# Altium schematic sheet csi.SchDoc
size 420 x 297 mm
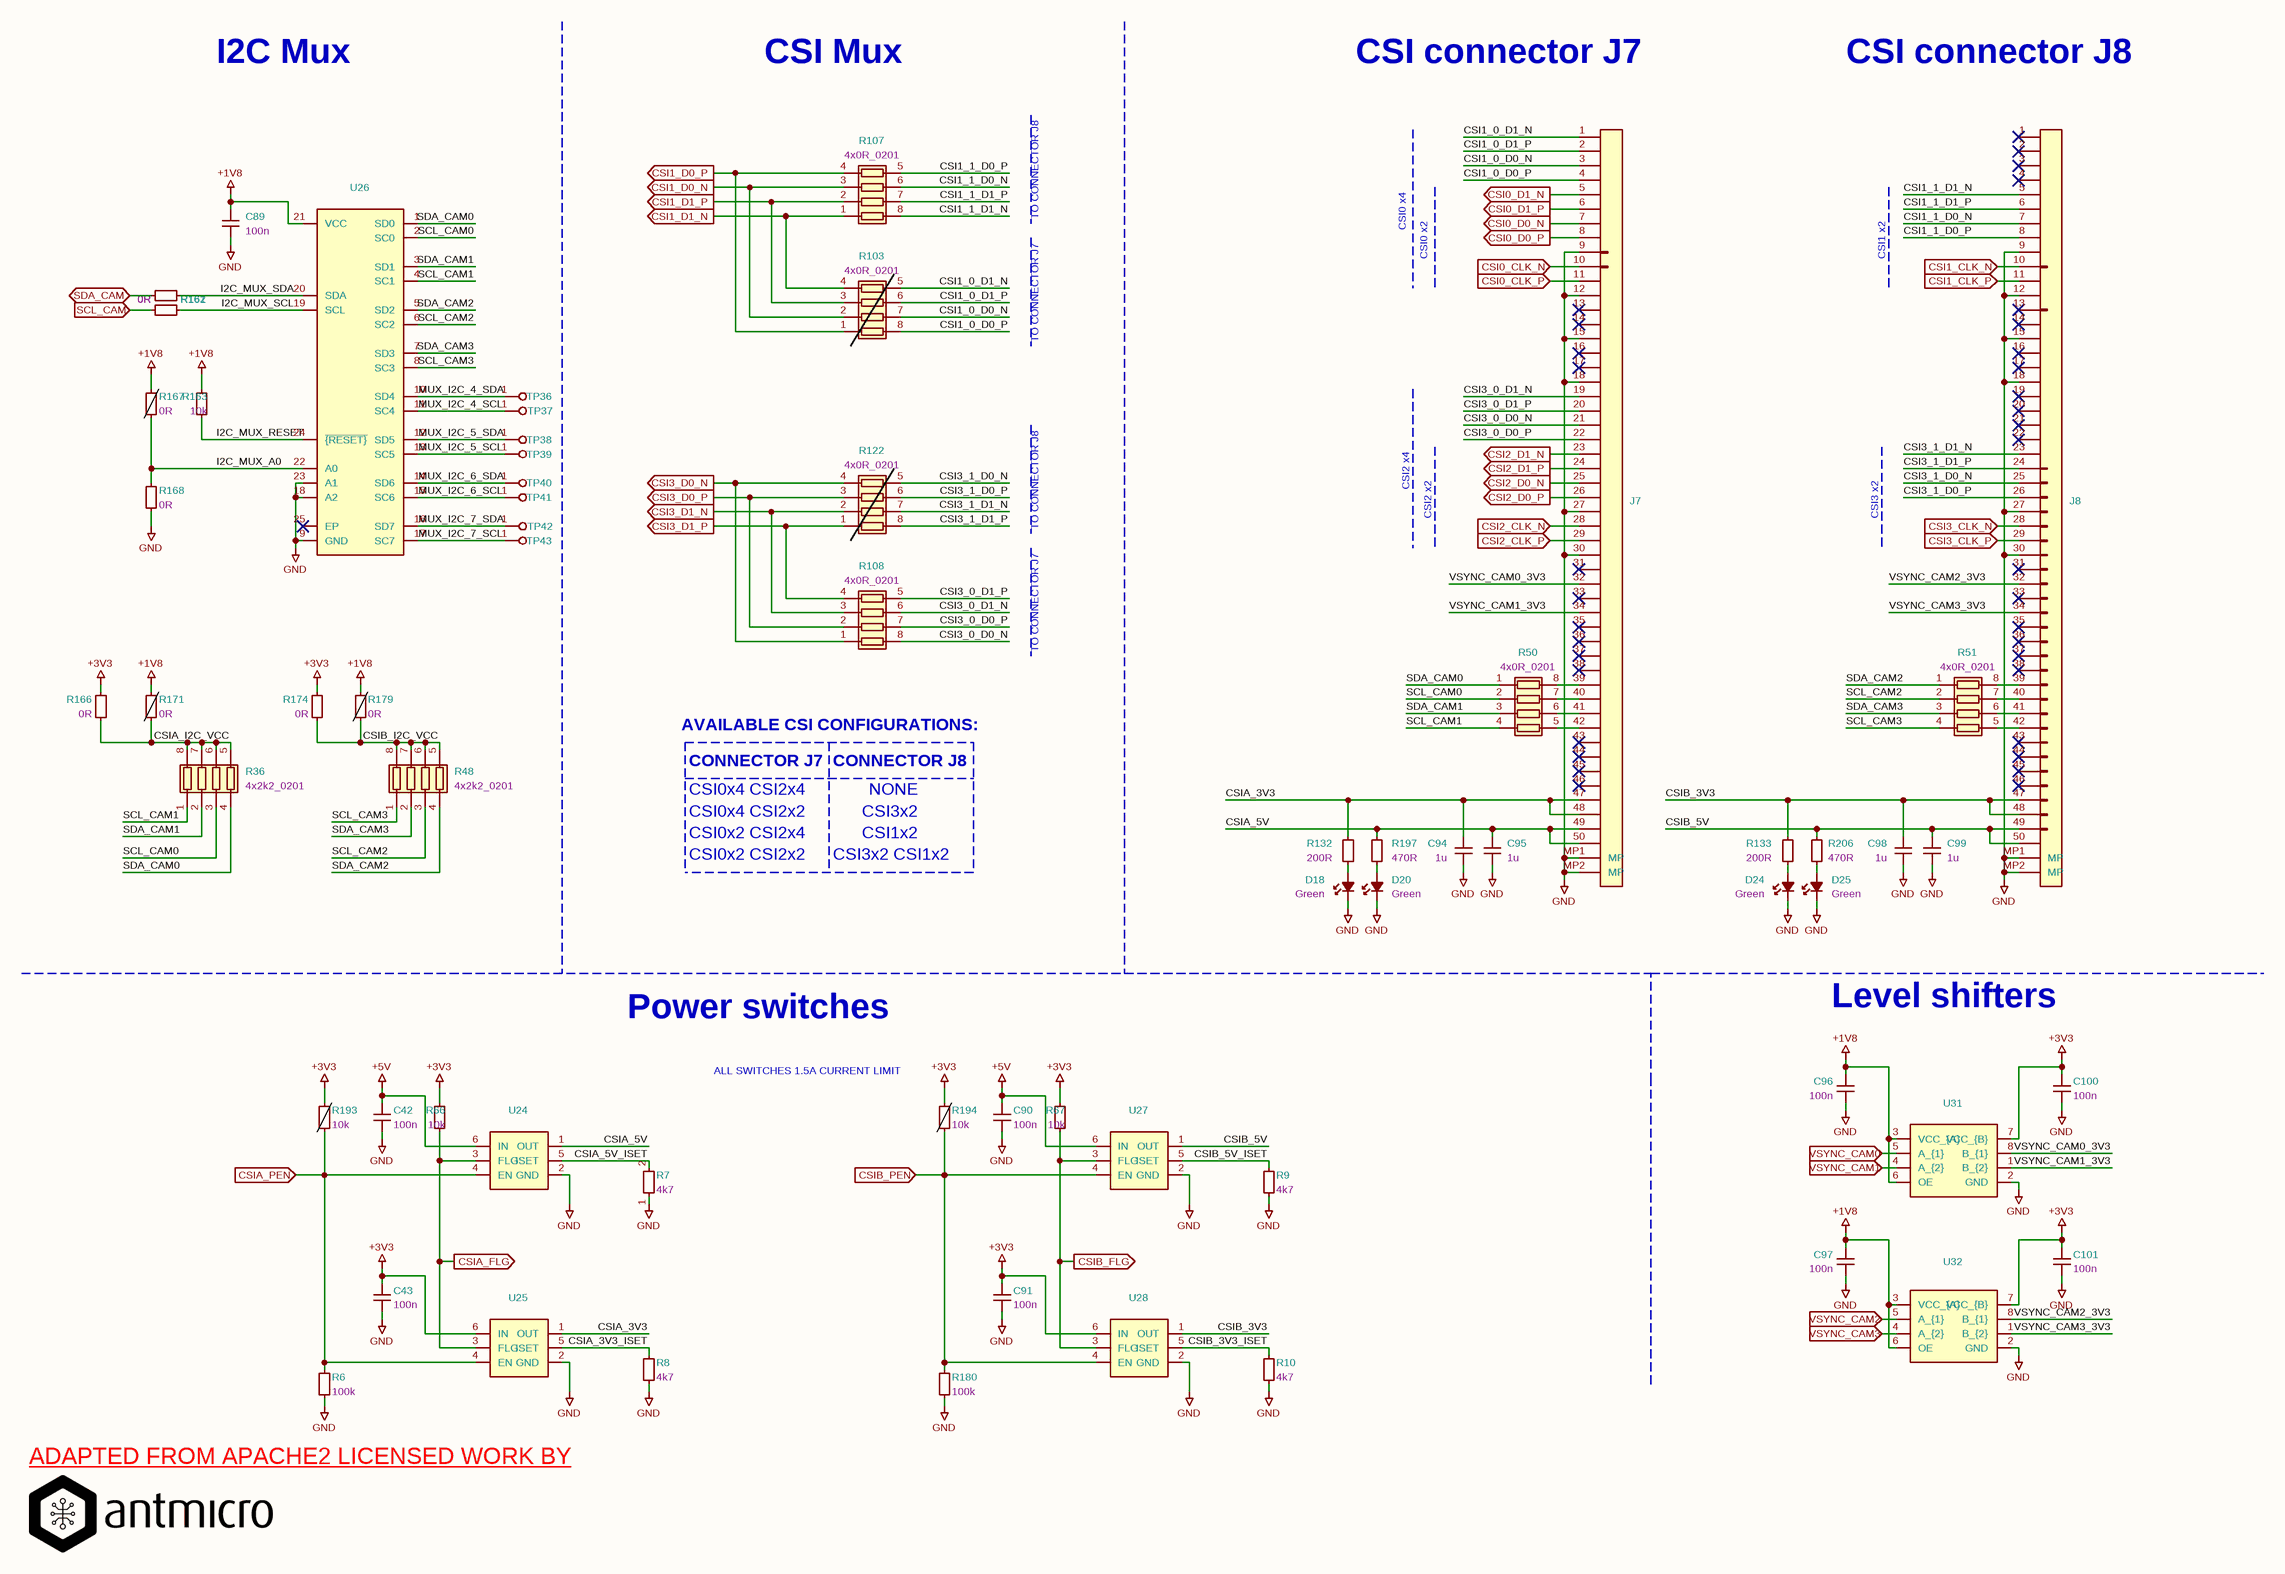
[diagram p0: csi.SchDoc]

## Parts
C42  Val: 100n  [C_0402_1005Metric]  (hidden comment: GRM155R61H104KE14D)
C43  Val: 100n  [C_0402_1005Metric]  (hidden comment: GRM155R61H104KE14D)
C89  Val: 100n  [C_0402_1005Metric]  (hidden comment: GRM155R61H104KE14D)
C90  Val: 100n  [C_0402_1005Metric]  (hidden comment: GRM155R61H104KE14D)
C91  Val: 100n  [C_0402_1005Metric]  (hidden comment: GRM155R61H104KE14D)
C94  Val: 1u  [C_0402_1005Metric]  (hidden comment: C1005X6S1A105K050BC)
C95  Val: 1u  [C_0402_1005Metric]  (hidden comment: C1005X6S1A105K050BC)
C96  Val: 100n  [C_0402_1005Metric]  (hidden comment: GRM155R61H104KE14D)
C97  Val: 100n  [C_0402_1005Metric]  (hidden comment: GRM155R61H104KE14D)
C98  Val: 1u  [C_0402_1005Metric]  (hidden comment: C1005X6S1A105K050BC)
C99  Val: 1u  [C_0402_1005Metric]  (hidden comment: C1005X6S1A105K050BC)
C100  Val: 100n  [C_0402_1005Metric]  (hidden comment: GRM155R61H104KE14D)
C101  Val: 100n  [C_0402_1005Metric]  (hidden comment: GRM155R61H104KE14D)
D18  Color: Green  [LED_0603_1608Metric_G]  (hidden comment: LTST-C190GKT)
D20  Color: Green  [LED_0603_1608Metric_G]  (hidden comment: LTST-C190GKT)
D24  Color: Green  [LED_0603_1608Metric_G]  (hidden comment: LTST-C190GKT)
D25  Color: Green  [LED_0603_1608Metric_G]  (hidden comment: LTST-C190GKT)
J7  68715014522  [Conn_FFC_WE_68715014x22]  (value not drawn)
J8  68715014522  [Conn_FFC_WE_68715014x22]  (value not drawn)
R6  Val: 100k  [R_0402_1005Metric]  (hidden comment: CR0402-FX-1003GLF)
R7  Val: 4k7  [R_0402_1005Metric]  (hidden comment: CR0402-FX-4701GLF)
R8  Val: 4k7  [R_0402_1005Metric]  (hidden comment: CR0402-FX-4701GLF)
R9  Val: 4k7  [R_0402_1005Metric]  (hidden comment: CR0402-FX-4701GLF)
R10  Val: 4k7  [R_0402_1005Metric]  (hidden comment: CR0402-FX-4701GLF)
R36  Val: 4x2k2_0201  [R_Array_4x0201_Panasonic_EXB18V]  (hidden comment: EXB-18V222JX)
R48  Val: 4x2k2_0201  [R_Array_4x0201_Panasonic_EXB18V]  (hidden comment: EXB-18V222JX)
R50  Val: 4x0R_0201  [R_Array_4x0201_Panasonic_EXB18V]  (hidden comment: EXB-18VR000X)
R51  Val: 4x0R_0201  [R_Array_4x0201_Panasonic_EXB18V]  (hidden comment: EXB-18VR000X)
R66  Val: 10k  [R_0402_1005Metric]  (hidden comment: CR0402-FX-1002GLF)
R67  Val: 10k  [R_0402_1005Metric]  (hidden comment: CR0402-FX-1002GLF)
R103  Val: 4x0R_0201  [R_Array_4x0201_Panasonic_EXB18V]  (hidden comment: EXB-18VR000X)  (no BOM)
R107  Val: 4x0R_0201  [R_Array_4x0201_Panasonic_EXB18V]  (hidden comment: EXB-18VR000X)
R108  Val: 4x0R_0201  [R_Array_4x0201_Panasonic_EXB18V]  (hidden comment: EXB-18VR000X)
R122  Val: 4x0R_0201  [R_Array_4x0201_Panasonic_EXB18V]  (hidden comment: EXB-18VR000X)  (no BOM)
R132  Val: 200R  [R_0402_1005Metric]  (hidden comment: CR0402-FX-2000GLF)
R133  Val: 200R  [R_0402_1005Metric]  (hidden comment: CR0402-FX-2000GLF)
R161  Val: 0R  [R_0402_1005Metric]  (hidden comment: ERJ2GE0R00X)
R162  Val: 0R  [R_0402_1005Metric]  (hidden comment: ERJ2GE0R00X)
R163  Val: 10k  [R_0402_1005Metric]  (hidden comment: CR0402-FX-1002GLF)
R166  Val: 0R  [R_0402_1005Metric]  (hidden comment: ERJ2GE0R00X)
R167  Val: 0R  [R_0402_1005Metric]  (hidden comment: ERJ2GE0R00X)  (no BOM)
R168  Val: 0R  [R_0402_1005Metric]  (hidden comment: ERJ2GE0R00X)
R171  Val: 0R  [R_0402_1005Metric]  (hidden comment: ERJ2GE0R00X)  (no BOM)
R174  Val: 0R  [R_0402_1005Metric]  (hidden comment: ERJ2GE0R00X)
R179  Val: 0R  [R_0402_1005Metric]  (hidden comment: ERJ2GE0R00X)  (no BOM)
R180  Val: 100k  [R_0402_1005Metric]  (hidden comment: CR0402-FX-1003GLF)
R193  Val: 10k  [R_0402_1005Metric]  (hidden comment: CR0402-FX-1002GLF)  (no BOM)
R194  Val: 10k  [R_0402_1005Metric]  (hidden comment: CR0402-FX-1002GLF)  (no BOM)
R197  Val: 470R  [R_0402_1005Metric]  (hidden comment: CR0402-FX-4700GLF)
R206  Val: 470R  [R_0402_1005Metric]  (hidden comment: CR0402-FX-4700GLF)
TP36  TP_0.75mm_SMD  [TP_SMD_0.75mm]  (value not drawn)  (no BOM)
TP37  TP_0.75mm_SMD  [TP_SMD_0.75mm]  (value not drawn)  (no BOM)
TP38  TP_0.75mm_SMD  [TP_SMD_0.75mm]  (value not drawn)  (no BOM)
TP39  TP_0.75mm_SMD  [TP_SMD_0.75mm]  (value not drawn)  (no BOM)
TP40  TP_0.75mm_SMD  [TP_SMD_0.75mm]  (value not drawn)  (no BOM)
TP41  TP_0.75mm_SMD  [TP_SMD_0.75mm]  (value not drawn)  (no BOM)
TP42  TP_0.75mm_SMD  [TP_SMD_0.75mm]  (value not drawn)  (no BOM)
TP43  TP_0.75mm_SMD  [TP_SMD_0.75mm]  (value not drawn)  (no BOM)
U24  AP22615AWU-7  [TSOT23-6]  (value not drawn)
U25  AP22615AWU-7  [TSOT23-6]  (value not drawn)
U26  PI4MSD5V9548AZDEX  [VQFN-24-1EP_3.8x3.8x1.0mm_P0.5mm]  (value not drawn)
U27  AP22615AWU-7  [TSOT23-6]  (value not drawn)
U28  AP22615AWU-7  [TSOT23-6]  (value not drawn)
U31  NTS0102GT  [XSON-8_1x1.95mm_P0.5mm]  (value not drawn)
U32  NTS0102GT  [XSON-8_1x1.95mm_P0.5mm]  (value not drawn)

## Ports
CSI0_CLK_N (in), CSI0_CLK_P (in), CSI0_D0_N (out), CSI0_D0_P (out), CSI0_D1_N (out), CSI0_D1_P (out), CSI1_CLK_N (in), CSI1_CLK_P (in), CSI1_D0_N (out), CSI1_D0_P (out), CSI1_D1_N (out), CSI1_D1_P (out), CSI2_CLK_N (in), CSI2_CLK_P (in), CSI2_D0_N (out), CSI2_D0_P (out), CSI2_D1_N (out), CSI2_D1_P (out), CSI3_CLK_N (in), CSI3_CLK_P (in), CSI3_D0_N (out), CSI3_D0_P (out), CSI3_D1_N (out), CSI3_D1_P (out), CSIA_FLG (out), CSIA_PEN (in), CSIB_FLG (out), CSIB_PEN (in), SCL_CAM (in), SDA_CAM (bidir), VSYNC_CAM0 (in), VSYNC_CAM1 (in), VSYNC_CAM2 (in), VSYNC_CAM3 (in)

## Nets
+1V8: C89.2 C96.2 C97.2 R163.1 R167.2 R171.2 R179.2 U26.21(VCC) U31.3(VCC_{A}) U31.6(OE) U32.3(VCC_{A}) U32.6(OE)
+3V3: C43.1 C91.1 C100.2 C101.2 R66.1 R67.1 R166.2 R174.2 R193.2 R194.2 U25.6(IN) U28.6(IN) U31.7(VCC_{B}) U32.7(VCC_{B})
+5V: C42.1 C90.1 U24.6(IN) U27.6(IN)
GND: C42.2 C43.2 C89.1 C90.2 C91.2 C94.1 C95.1 C96.1 C97.1 C98.1 C99.1 C100.1 C101.1 D18.1(C) D20.1(C) D24.1(C) D25.1(C) J7.9 J7.12 J7.15 J7.18 J7.27 J7.30 J7.MP1(MP) J7.MP2(MP) J8.9 J8.12 J8.15 J8.18 J8.27 J8.30 J8.MP1(MP) J8.MP2(MP) R6.1 R7.1 R8.1 R9.1 R10.1 R168.1 R180.1 U24.2(GND) U25.2(GND) U26.9(GND) U26.18(A2) U26.23(A1) U27.2(GND) U28.2(GND) U31.2(GND) U32.2(GND)
CSI0_CLK_N: J7.10 ; port CSI0_CLK_N
CSI0_CLK_P: J7.11 ; port CSI0_CLK_P
CSI0_D0_N: J7.7 ; port CSI0_D0_N
CSI0_D0_P: J7.8 ; port CSI0_D0_P
CSI0_D1_N: J7.5 ; port CSI0_D1_N
CSI0_D1_P: J7.6 ; port CSI0_D1_P
CSI1_0_D0_N: J7.3 R103.7(R2.2)
CSI1_0_D0_P: J7.4 R103.8(R1.2)
CSI1_0_D1_N: J7.1 R103.5(R4.2)
CSI1_0_D1_P: J7.2 R103.6(R3.2)
CSI1_1_D0_N: J8.7 R107.6(R3.2)
CSI1_1_D0_P: J8.8 R107.5(R4.2)
CSI1_1_D1_N: J8.5 R107.8(R1.2)
CSI1_1_D1_P: J8.6 R107.7(R2.2)
CSI1_CLK_N: J8.10 ; port CSI1_CLK_N
CSI1_CLK_P: J8.11 ; port CSI1_CLK_P
CSI1_D0_N: R103.2(R2.1) R107.3(R3.1) ; port CSI1_D0_N
CSI1_D0_P: R103.1(R1.1) R107.4(R4.1) ; port CSI1_D0_P
CSI1_D1_N: R103.4(R4.1) R107.1(R1.1) ; port CSI1_D1_N
CSI1_D1_P: R103.3(R3.1) R107.2(R2.1) ; port CSI1_D1_P
CSI2_CLK_N: J7.28 ; port CSI2_CLK_N
CSI2_CLK_P: J7.29 ; port CSI2_CLK_P
CSI2_D0_N: J7.25 ; port CSI2_D0_N
CSI2_D0_P: J7.26 ; port CSI2_D0_P
CSI2_D1_N: J7.23 ; port CSI2_D1_N
CSI2_D1_P: J7.24 ; port CSI2_D1_P
CSI3_0_D0_N: J7.21 R108.8(R1.2)
CSI3_0_D0_P: J7.22 R108.7(R2.2)
CSI3_0_D1_N: J7.19 R108.6(R3.2)
CSI3_0_D1_P: J7.20 R108.5(R4.2)
CSI3_1_D0_N: J8.25 R122.5(R4.2)
CSI3_1_D0_P: J8.26 R122.6(R3.2)
CSI3_1_D1_N: J8.23 R122.7(R2.2)
CSI3_1_D1_P: J8.24 R122.8(R1.2)
CSI3_CLK_N: J8.28 ; port CSI3_CLK_N
CSI3_CLK_P: J8.29 ; port CSI3_CLK_P
CSI3_D0_N: R108.1(R1.1) R122.4(R4.1) ; port CSI3_D0_N
CSI3_D0_P: R108.2(R2.1) R122.3(R3.1) ; port CSI3_D0_P
CSI3_D1_N: R108.3(R3.1) R122.2(R2.1) ; port CSI3_D1_N
CSI3_D1_P: R108.4(R4.1) R122.1(R1.1) ; port CSI3_D1_P
CSIA_3V3: C94.2 J7.47 J7.48 R132.2 U25.1(OUT)
CSIA_3V3_ISET: R8.2 U25.5(ISET)
CSIA_5V: C95.2 J7.49 J7.50 R197.2 U24.1(OUT)
CSIA_5V_ISET: R7.2 U24.5(ISET)
CSIA_FLG: R66.2 U24.3(FLG) U25.3(FLG) ; port CSIA_FLG
CSIA_I2C_VCC: R36.5(R4.2) R36.6(R3.2) R36.7(R2.2) R36.8(R1.2) R166.1 R171.1
CSIA_PEN: R6.2 R193.1 U24.4(EN) U25.4(EN) ; port CSIA_PEN
CSIB_3V3: C98.2 J8.47 J8.48 R133.2 U28.1(OUT)
CSIB_3V3_ISET: R10.2 U28.5(ISET)
CSIB_5V: C99.2 J8.49 J8.50 R206.2 U27.1(OUT)
CSIB_5V_ISET: R9.2 U27.5(ISET)
CSIB_FLG: R67.2 U27.3(FLG) U28.3(FLG) ; port CSIB_FLG
CSIB_I2C_VCC: R48.5(R4.2) R48.6(R3.2) R48.7(R2.2) R48.8(R1.2) R174.1 R179.1
CSIB_PEN: R180.2 R194.1 U27.4(EN) U28.4(EN) ; port CSIB_PEN
I2C_MUX_A0: R167.1 R168.2 U26.22(A0)
I2C_MUX_RESET: R163.2 U26.24(~{{RESET}})
I2C_MUX_SCL: R162.1 U26.19(SCL)
I2C_MUX_SDA: R161.1 U26.20(SDA)
MUX_I2C_4_SCL: TP37.1 U26.11(SC4)
MUX_I2C_4_SDA: TP36.1 U26.10(SD4)
MUX_I2C_5_SCL: TP39.1 U26.13(SC5)
MUX_I2C_5_SDA: TP38.1 U26.12(SD5)
MUX_I2C_6_SCL: TP41.1 U26.15(SC6)
MUX_I2C_6_SDA: TP40.1 U26.14(SD6)
MUX_I2C_7_SCL: TP43.1 U26.17(SC7)
MUX_I2C_7_SDA: TP42.1 U26.16(SD7)
SCL_CAM: R162.2 ; port SCL_CAM
SCL_CAM0: R36.3(R3.1) R50.2(R2.1) U26.2(SC0)
SCL_CAM1: R36.1(R1.1) R50.4(R4.1) U26.4(SC1)
SCL_CAM2: R48.3(R3.1) R51.2(R2.1) U26.6(SC2)
SCL_CAM3: R48.1(R1.1) R51.4(R4.1) U26.8(SC3)
SDA_CAM: R161.2 ; port SDA_CAM
SDA_CAM0: R36.4(R4.1) R50.1(R1.1) U26.1(SD0)
SDA_CAM1: R36.2(R2.1) R50.3(R3.1) U26.3(SD1)
SDA_CAM2: R48.4(R4.1) R51.1(R1.1) U26.5(SD2)
SDA_CAM3: R48.2(R2.1) R51.3(R3.1) U26.7(SD3)
VSYNC_CAM0: U31.5(A_{1}) ; port VSYNC_CAM0
VSYNC_CAM0_3V3: J7.32 U31.8(B_{1})
VSYNC_CAM1: U31.4(A_{2}) ; port VSYNC_CAM1
VSYNC_CAM1_3V3: J7.34 U31.1(B_{2})
VSYNC_CAM2: U32.5(A_{1}) ; port VSYNC_CAM2
VSYNC_CAM2_3V3: J8.32 U32.8(B_{1})
VSYNC_CAM3: U32.4(A_{2}) ; port VSYNC_CAM3
VSYNC_CAM3_3V3: J8.34 U32.1(B_{2})
NetD18_2: D18.2(A) R132.1
NetD20_2: D20.2(A) R197.1
NetD24_2: D24.2(A) R133.1
NetD25_2: D25.2(A) R206.1
NetJ7_39: J7.39 R50.8(R1.2)
NetJ7_40: J7.40 R50.7(R2.2)
NetJ7_41: J7.41 R50.6(R3.2)
NetJ7_42: J7.42 R50.5(R4.2)
NetJ8_39: J8.39 R51.8(R1.2)
NetJ8_40: J8.40 R51.7(R2.2)
NetJ8_41: J8.41 R51.6(R3.2)
NetJ8_42: J8.42 R51.5(R4.2)

Not connected (* = marked no-connect by the designer): J7 13* 14* 16* 17* 31* 33* 35* 36* 37* 38* 43* 44* 45* 46*; J8 1* 2* 3* 4* 13* 14* 16* 17* 19* 20* 21* 22* 31* 33* 35* 36* 37* 38* 43* 44* 45* 46*; U26 25(EP)*

## Notes on the sheet
- I2C Mux
- CSI Mux
- CSI connector J7
- CSI connector J8
- TO CONNECTOR J8
- CSI0 x4
- CSI0 x2
- CSI1 x2
- TO CONNECTOR J7
- CSI2 x4
- CSI2 x2
- CSI3 x2
- AVAILABLE CSI CONFIGURATIONS:
- CONNECTOR J7
- CSI0x4 CSI2x4
- CONNECTOR J8
- NONE
- CSI0x2 CSI2x2
- CSI0x4 CSI2x2
- CSI0x2 CSI2x4
- CSI3x2 CSI1x2
- CSI1x2
- CSI3x2
- Level shifters
- Power switches
- ALL SWITCHES
  1.5A CURRENT LIMIT
- (near R6) ADAPTED FROM APACHE2 LICENSED WORK BY <https://github.com/antmicro/jetson-orin-baseboard>
- 1
- 2
- 3
- 4
- 5
- 6
- 7
- 8
- A
- B
- C
- D
- E
- www.antmicro.com <http://www.antmicro.com>
- Title: Jetson Orin Baseboard
- File: csi.kicad_sch
- Sheet: /
- Antmicro Ltd
- F
- KiCad E.D.A.  kicad (5.1.4)-1
- Size: A3
- Date: 2025-01-15
- Rev: 1.3.0
- Id: 1/1

## Library data of the parts
C42 C43 C89-C91 C96 C97 C100 C101 = C_100n_0402: Manufacturer 1: Murata; License: Apache-2.0; Voltage: 50V; Dielectric: X5R; Author: Antmicro; OldValue: C_100n_0402; Manufacturer Part Number 1: GRM155R61H104KE14D; Value: GRM155R61H104KE14D; Footprint: antmicro-footprints:C_0402_1005Metric
C94 C95 C98 C99 = C_1u_0402: Manufacturer 1: TDK; License: Apache-2.0; Author: Antmicro; OldValue: C_1u_0402; Manufacturer Part Number 1: C1005X6S1A105K050BC; Value: C1005X6S1A105K050BC; Footprint: antmicro-footprints:C_0402_1005Metric
D18 D20 D24 D25 = LED_G_0603_LTST-C190GKT: Manufacturer 1: Lite-On; License: Apache-2.0; Author: Antmicro; OldValue: LED_G_0603_LTST-C190GKT; Manufacturer Part Number 1: LTST-C190GKT; Value: LTST-C190GKT; Footprint: antmicro-footprints:LED_0603_1608Metric_G
J7 J8 = Conn_FFC_WE_68715014522: Manufacturer 1: Würth Elektronik; License: Apache-2.0; Author: Antmicro; OldValue: Conn_FFC_WE_68715014522; Manufacturer Part Number 1: 68715014522; Value: 68715014522; Footprint: antmicro-footprints:Conn_FFC_WE_68715014x22
R6 R180 = R_100k_0402: Manufacturer 1: Bourns; License: Apache-2.0; Tolerance: 1%; Author: Antmicro; OldValue: R_100k_0402; Manufacturer Part Number 1: CR0402-FX-1003GLF; Value: CR0402-FX-1003GLF; Footprint: antmicro-footprints:R_0402_1005Metric
R7-R10 = R_4k7_0402: Manufacturer 1: Bourns; License: Apache-2.0; Tolerance: 1%; Author: Antmicro; OldValue: R_4k7_0402; Manufacturer Part Number 1: CR0402-FX-4701GLF; Value: CR0402-FX-4701GLF; Footprint: antmicro-footprints:R_0402_1005Metric
R36 R48 = R_4x2k2_0201_array: Manufacturer 1: Panasonic; License: Apache-2.0; Author: Antmicro; OldValue: R_4x2k2_0201_array; Manufacturer Part Number 1: EXB-18V222JX; Value: EXB-18V222JX; Footprint: antmicro-footprints:R_Array_4x0201_Panasonic_EXB18V
R50 R51 R103 R107 R108 R122 = R_4x0R_0201_array: Manufacturer 1: Panasonic; License: Apache-2.0; Author: Antmicro; OldValue: R_4x0R_0201_array; Manufacturer Part Number 1: EXB-18VR000X; Value: EXB-18VR000X; Footprint: antmicro-footprints:R_Array_4x0201_Panasonic_EXB18V
R66 R67 R163 R193 R194 = R_10k_0402: Manufacturer 1: Bourns; License: Apache-2.0; Tolerance: 1%; Author: Antmicro; OldValue: R_10k_0402; Manufacturer Part Number 1: CR0402-FX-1002GLF; Value: CR0402-FX-1002GLF; Footprint: antmicro-footprints:R_0402_1005Metric
R132 R133 = R_200R_0402: Manufacturer 1: Bourns; License: Apache-2.0; Tolerance: 1%; Author: Antmicro; OldValue: R_200R_0402; Manufacturer Part Number 1: CR0402-FX-2000GLF; Value: CR0402-FX-2000GLF; Footprint: antmicro-footprints:R_0402_1005Metric
R161 R162 R166-R168 R171 R174 R179 = R_0R_0402: Manufacturer 1: Panasonic; License: Apache-2.0; Tolerance: ~; Current: 1A; Author: Antmicro; OldValue: R_0R_0402; Manufacturer Part Number 1: ERJ2GE0R00X; Value: ERJ2GE0R00X; Footprint: antmicro-footprints:R_0402_1005Metric
R197 R206 = R_470R_0402: Manufacturer 1: Bourns; License: Apache-2.0; Tolerance: 1%; Author: Antmicro; OldValue: R_470R_0402; Manufacturer Part Number 1: CR0402-FX-4700GLF; Value: CR0402-FX-4700GLF; Footprint: antmicro-footprints:R_0402_1005Metric
TP36-TP43 = TP_0.75mm_SMD: License: Apache-2.0; Author: Antmicro; OldValue: TP_0.75mm_SMD; Value: TP_0.75mm_SMD; Footprint: antmicro-footprints:TP_SMD_0.75mm
U24 U25 U27 U28 = AP22615A_TSOT26: Manufacturer 1: Diodes Incorporated; License: Apache-2.0; Author: Antmicro; OldValue: AP22615A_TSOT26; Manufacturer Part Number 1: AP22615AWU-7; Value: AP22615AWU-7; Footprint: antmicro-footprints:TSOT23-6
U26 = PI4MSD5V9548AZDEX: Manufacturer 1: Diodes Incorporated; License: Apache-2.0; Author: Antmicro; OldValue: PI4MSD5V9548AZDEX; Manufacturer Part Number 1: PI4MSD5V9548AZDEX; Value: PI4MSD5V9548AZDEX; Footprint: antmicro-footprints:VQFN-24-1EP_3.8x3.8x1.0mm_P0.5mm
U31 U32 = NTS0102_XSON: Manufacturer 1: NXP; License: Apache-2.0; Author: Antmicro; OldValue: NTS0102_XSON; Manufacturer Part Number 1: NTS0102GT; Value: NTS0102GT; Footprint: antmicro-footprints:XSON-8_1x1.95mm_P0.5mm